# EAGLE schematic adcfft (EAGLE 9.4.1)
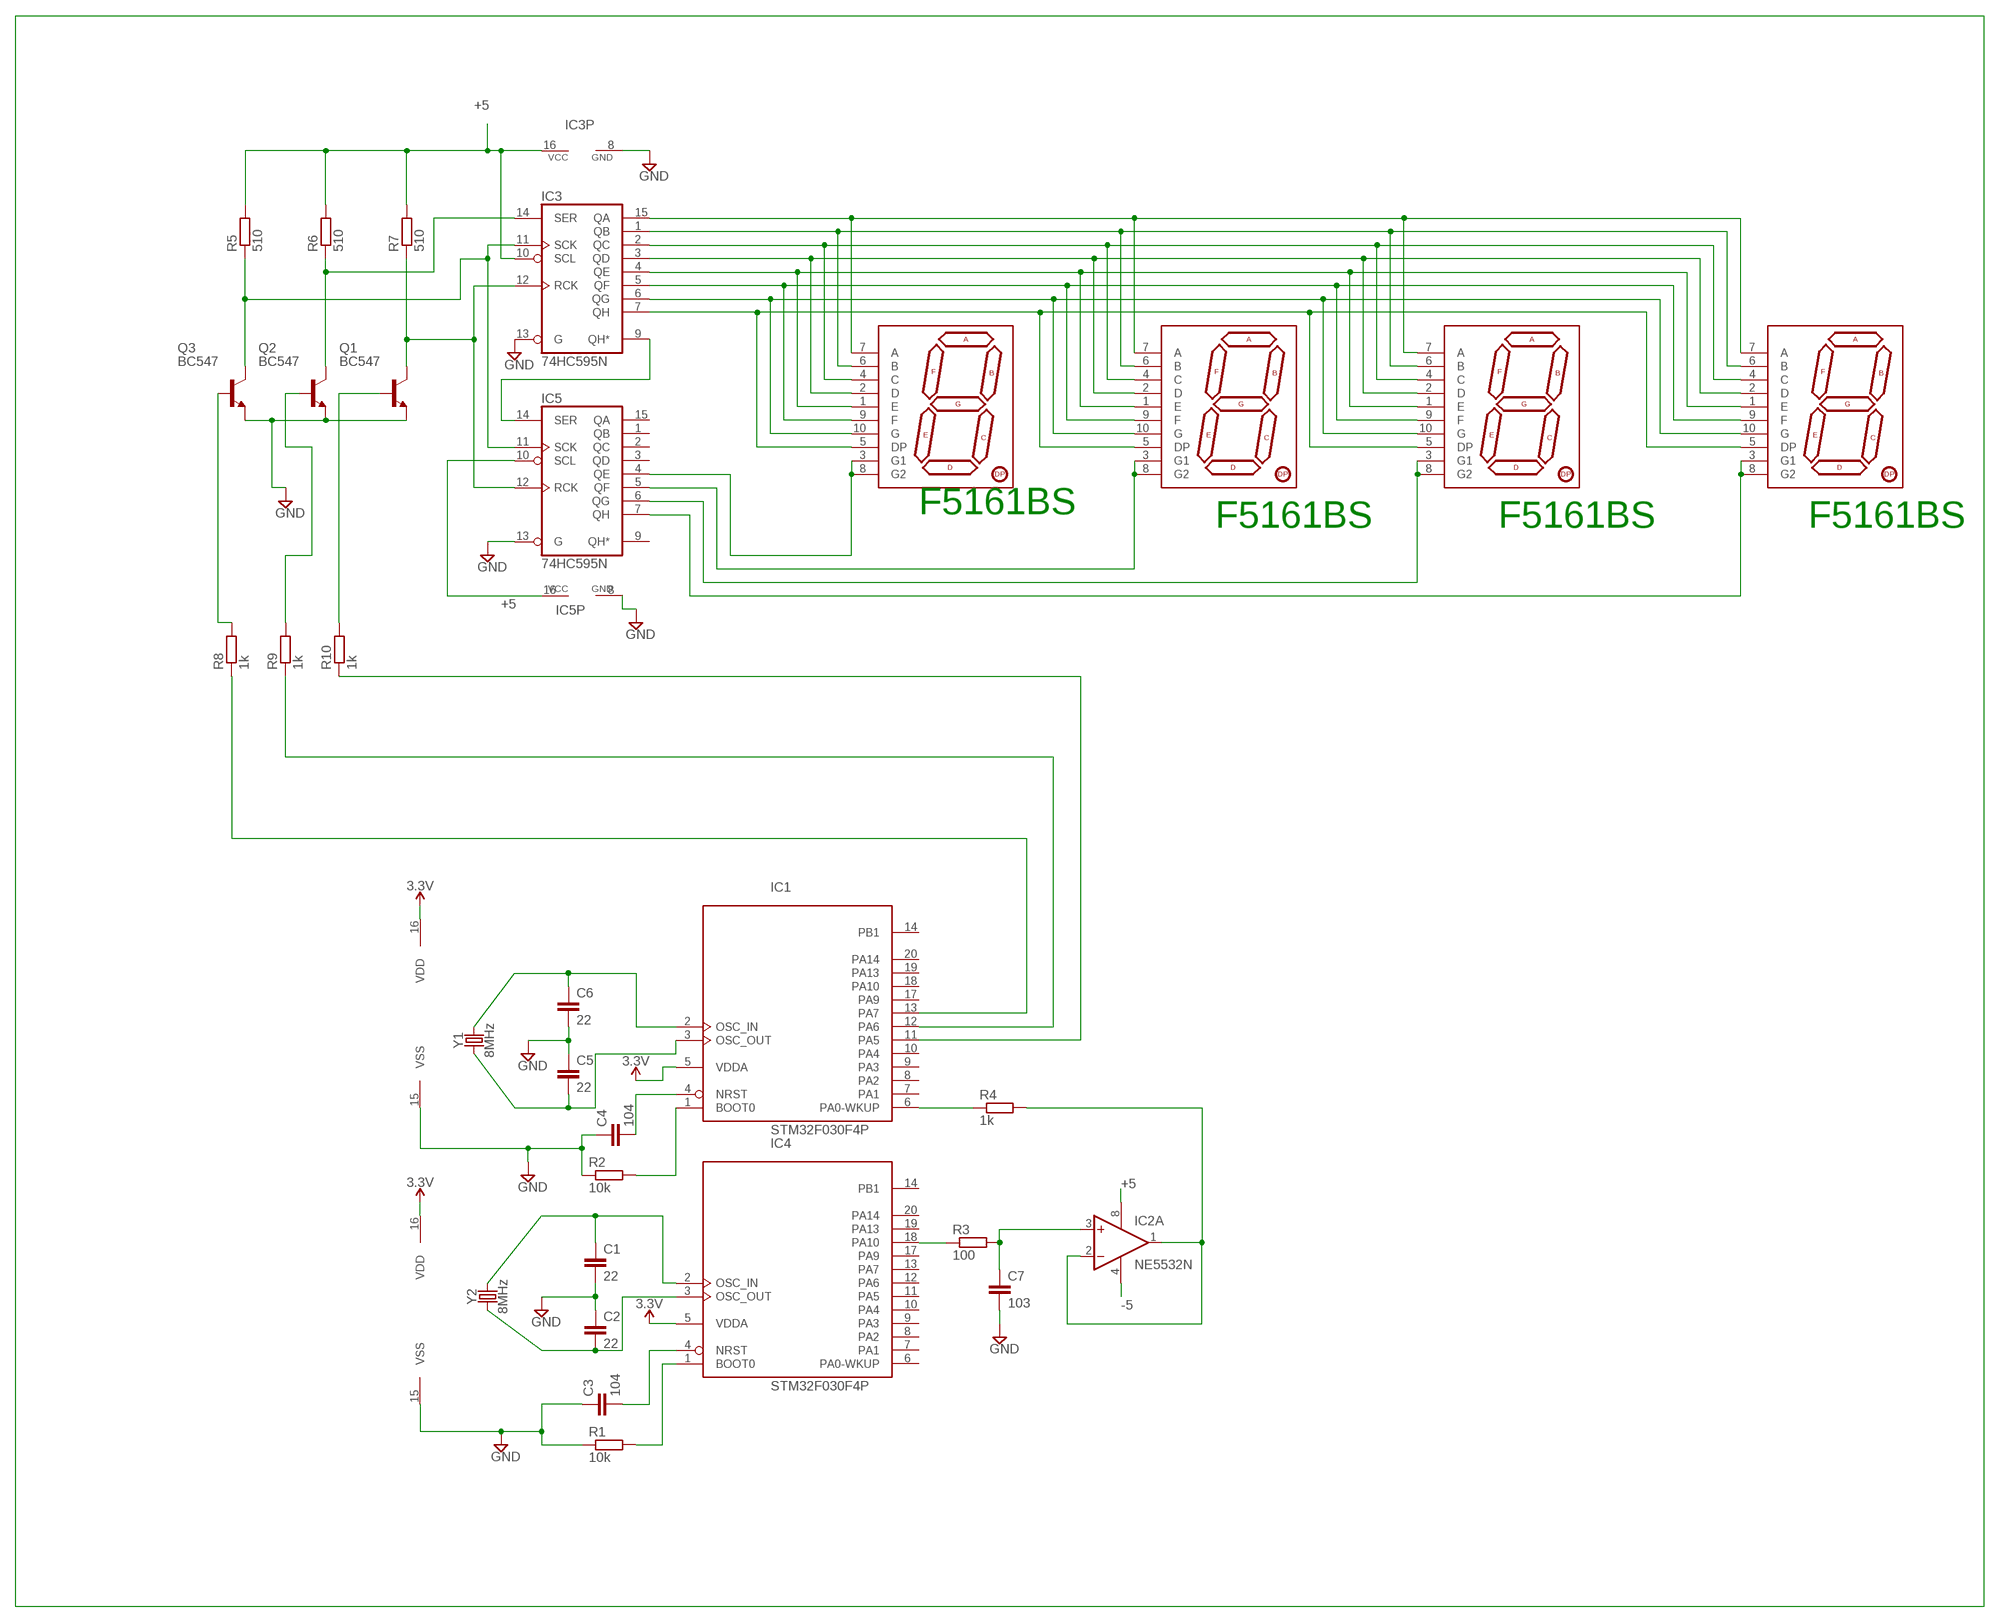
[diagram p0: schematic, sheet 1]

## Parts
C1  22  C-EUC0504  [C0504]
C2  22  C-EUC0504  [C0504]
C3  104  C-EUC0504  [C0504]
C4  104  C-EUC0504  [C0504]
C5  22  C-EUC0504  [C0504]
C6  22  C-EUC0504  [C0504]
C7  103  C-EUC0504  [C0504]
IC1  STM32F030F4P  [TSSOP20-I]
IC2  NE5532N  [DIL08]
IC3  74HC595N  [DIL16]
IC4  STM32F030F4P  [TSSOP20-I]
IC5  74HC595N  [DIL16]
Q1  BC547  [TO92]
Q2  BC547  [TO92]
Q3  BC547  [TO92]
R1  10k  R-EU_0207/10  [0207/10]
R2  10k  R-EU_0207/10  [0207/10]
R3  100  R-EU_0207/10  [0207/10]
R4  1k  R-EU_0207/10  [0207/10]
R5  510  R-EU_0207/10  [0207/10]
R6  510  R-EU_0207/10  [0207/10]
R7  510  R-EU_0207/10  [0207/10]
R8  1k  R-EU_0207/10  [0207/10]
R9  1k  R-EU_0207/10  [0207/10]
R10  1k  R-EU_0207/10  [0207/10]
U$1  F5161BS  7-SEGMENT-1DIGIT-1INCH-BLUE  [7-SEGMENT-1"PTH]
U$2  F5161BS  7-SEGMENT-1DIGIT-1INCH-BLUE  [7-SEGMENT-1"PTH]
U$3  F5161BS  7-SEGMENT-1DIGIT-1INCH-BLUE  [7-SEGMENT-1"PTH]
U$4  F5161BS  7-SEGMENT-1DIGIT-1INCH-BLUE  [7-SEGMENT-1"PTH]
Y1  8MHz  CRYSTAL-8MHZSMD-HC49UP  [HC49UP]
Y2  8MHz  CRYSTAL-8MHZSMD-HC49UP  [HC49UP]

## Nets
3.3V: IC1.5(VDDA) IC1.16(VDD) IC4.5(VDDA) IC4.16(VDD)
+5: IC2.8(P:V+) IC3.10(SCL) IC3.16(VCC) IC5.10(SCL) IC5.16(VCC) R5.2 R6.2 R7.2
-5: IC2.4(P:V-)
GND: C1.2 C2.1 C3.1 C4.1 C5.1 C6.2 C7.2 IC1.15(VSS) IC3.8(GND) IC3.13(G) IC4.15(VSS) IC5.8(GND) IC5.13(G) Q1.1(E) Q2.1(E) Q3.1(E) R1.1 R2.1
N$1: C6.1 IC1.2(OSC_IN) Y1.2
N$2: C4.2 IC1.4(NRST)
N$3: C1.1 IC4.2(OSC_IN) Y2.2
N$4: C5.2 IC1.3(OSC_OUT) Y1.1
N$5: C3.2 IC4.4(NRST)
N$6: C2.2 IC4.3(OSC_OUT) Y2.1
N$7: IC1.1(BOOT0) R2.2
N$8: IC4.1(BOOT0) R1.2
N$9: IC2.1(A:OUT) IC2.2(A:-IN) R4.2
N$10: IC4.18(PA10) R3.1
N$11: C7.1 IC2.3(A:+IN) R3.2
N$12: IC1.6(PA0-WKUP) R4.1
N$13: IC3.15(QA) U$1.7(A) U$2.7(A) U$3.7(A) U$4.7(A)
N$14: IC3.9(QH*) IC5.14(SER)
N$17: IC3.1(QB) U$1.6(B) U$2.6(B) U$3.6(B) U$4.6(B)
N$18: IC3.2(QC) U$1.4(C) U$2.4(C) U$3.4(C) U$4.4(C)
N$19: IC3.3(QD) U$1.2(D) U$2.2(D) U$3.2(D) U$4.2(D)
N$20: IC3.4(QE) U$1.1(E) U$2.1(E) U$3.1(E) U$4.1(E)
N$21: IC3.5(QF) U$1.9(F) U$2.9(F) U$3.9(F) U$4.9(F)
N$22: IC3.6(QG) U$1.10(G) U$2.10(G) U$3.10(G) U$4.10(G)
N$23: IC3.7(QH) U$1.5(DP) U$2.5(DP) U$3.5(DP) U$4.5(DP)
N$24: Q3.2(B) R8.2
N$25: IC3.12(RCK) IC5.12(RCK) Q1.3(C) R7.1
N$26: IC5.7(QH) U$4.3(G1) U$4.8(G2)
N$27: IC5.6(QG) U$3.3(G1) U$3.8(G2)
N$28: Q2.2(B) R9.2
N$29: Q1.2(B) R10.2
N$30: IC5.5(QF) U$2.3(G1) U$2.8(G2)
N$31: IC1.11(PA5) R10.1
N$32: IC1.12(PA6) R9.1
N$33: IC1.13(PA7) R8.1
N$34: IC5.4(QE) U$1.3(G1) U$1.8(G2)
N$36: IC3.11(SCK) IC5.11(SCK) Q3.3(C) R5.1
N$37: IC3.14(SER) Q2.3(C) R6.1
Unconnected: IC1.7(PA1) IC1.8(PA2) IC1.9(PA3) IC1.10(PA4) IC1.14(PB1) IC1.17(PA9) IC1.18(PA10) IC1.19(PA13) IC1.20(PA14) IC2.5(B:+IN) IC2.6(B:-IN) IC2.7(B:OUT) IC4.6(PA0-WKUP) IC4.7(PA1) IC4.8(PA2) IC4.9(PA3) IC4.10(PA4) IC4.11(PA5) IC4.12(PA6) IC4.13(PA7) IC4.14(PB1) IC4.17(PA9) IC4.19(PA13) IC4.20(PA14) IC5.1(QB) IC5.2(QC) IC5.3(QD) IC5.9(QH*) IC5.15(QA)

## Notes on the sheet
- F5161BS
- F5161BS | F5161BS | F5161BS

## Library data of the parts
C1-C7 = rcl:C-EU: CAPACITOR, European symbol; SPICEPREFIX: C
IC1 IC4 = micro-stm_v3:STM32F030F*P: ARM 32-bit Cortex™-M0 CPU 48 MHz maximum frequency 16 Kbytes of Flash memory 4 kbytes of SRAM 15 GPIOs 2.4 to 3.6 V application supply
IC2 = linear:NE5532: AUDIO AMPLIFIER
IC3 IC5 = 74xx-eu:74*595: 8-bit SHIFT REGISTER, output latch
Q1-Q3 = transistor-npn:BC547*: NPN Transistor
R1-R10 = rcl:R-EU_: RESISTOR, European symbol; SPICEPREFIX: R
U$1-U$4 = SparkFun-LED:7-SEGMENT-1DIGIT-1INCH: 7-Segment Display, single digit, 1" EZ is for kits. Pads are only exposed on the bottom side to help prevent soldering in upside down. Datasheet (Red) <https://cdn.sparkfun.com/datasheets/Components/LED/YSD-160AR4B-8.pdf> Datasheet (Blue) <https://cdn.sparkfun.com/datasheets/Components/LED/YSD-160AB3C-8.pdf> SparkFun Products 7-Segment Display - LED (Red) <https://www.sparkfun.com/products/8546> (COM-08546) 7-Segment Display - LED (Blue) <https://www.sparkfun.com/products/9191> (COM-09191); PROD_ID: COMP-09495; VALUE: YSD-160AB3C-8
Y1 Y2 = SparkFun-Clocks:CRYSTAL-8MHZ: 8MHz Crystal Datasheet Example <http://www.futureelectronics.com/en/technologies/electromechanical/timing-devices/crystals/Pages/6008189-ABM3B-8.000MHZ-B2-T.aspx?IM=0> Frequency: 8MHz Frequency Tolerance: ±20ppm Load Capacitance: 18pF SparkFun Products: Pro Micro -3.3V/8MHz <https://www.sparkfun.com/products/12587> WAV Trigger <https://www.sparkfun.com/products/13660>; PROD_ID: XTAL-11706